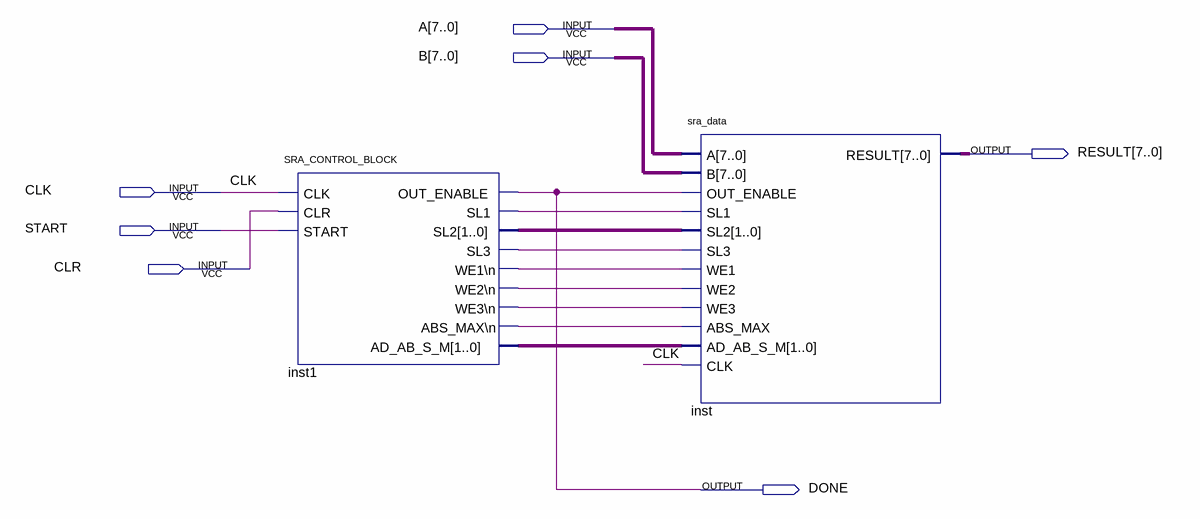
[diagram p0: schematic sheet]
// Quartus schematic sra_final2.bdf as structural Verilog: 2 symbols, 7 pins
module sra_final2 (
  input  [7:0] A,
  input  [7:0] B,
  input  CLK,
  input  START,
  input  CLR,
  output [7:0] RESULT,
  output DONE
);

  wire inst1_abs_max_n, inst1_sl1, inst1_sl3, inst1_we1_n, inst1_we2_n, inst1_we3_n;
  wire [1:0] inst1_ad_ab_s_m, inst1_sl2;

  SRA_CONTROL_BLOCK inst1 (
    .CLK(CLK), .CLR(CLR), .START(START), .OUT_ENABLE(DONE), .SL1(inst1_sl1), .SL2(inst1_sl2),
    .SL3(inst1_sl3), .\WE1\n (inst1_we1_n), .\WE2\n (inst1_we2_n), .\WE3\n (inst1_we3_n),
    .\ABS_MAX\n (inst1_abs_max_n), .AD_AB_S_M(inst1_ad_ab_s_m));
  sra_data inst (
    .A(A), .B(B), .OUT_ENABLE(DONE), .SL1(inst1_sl1), .SL2(inst1_sl2), .SL3(inst1_sl3), .WE1(inst1_we1_n),
    .WE2(inst1_we2_n), .WE3(inst1_we3_n), .ABS_MAX(inst1_abs_max_n), .AD_AB_S_M(inst1_ad_ab_s_m), .CLK(CLK),
    .RESULT(RESULT));
endmodule
